# Altium schematic sheet BQ25750.SchDoc
size A4; SheetNumber: 1; SheetTotal: 3
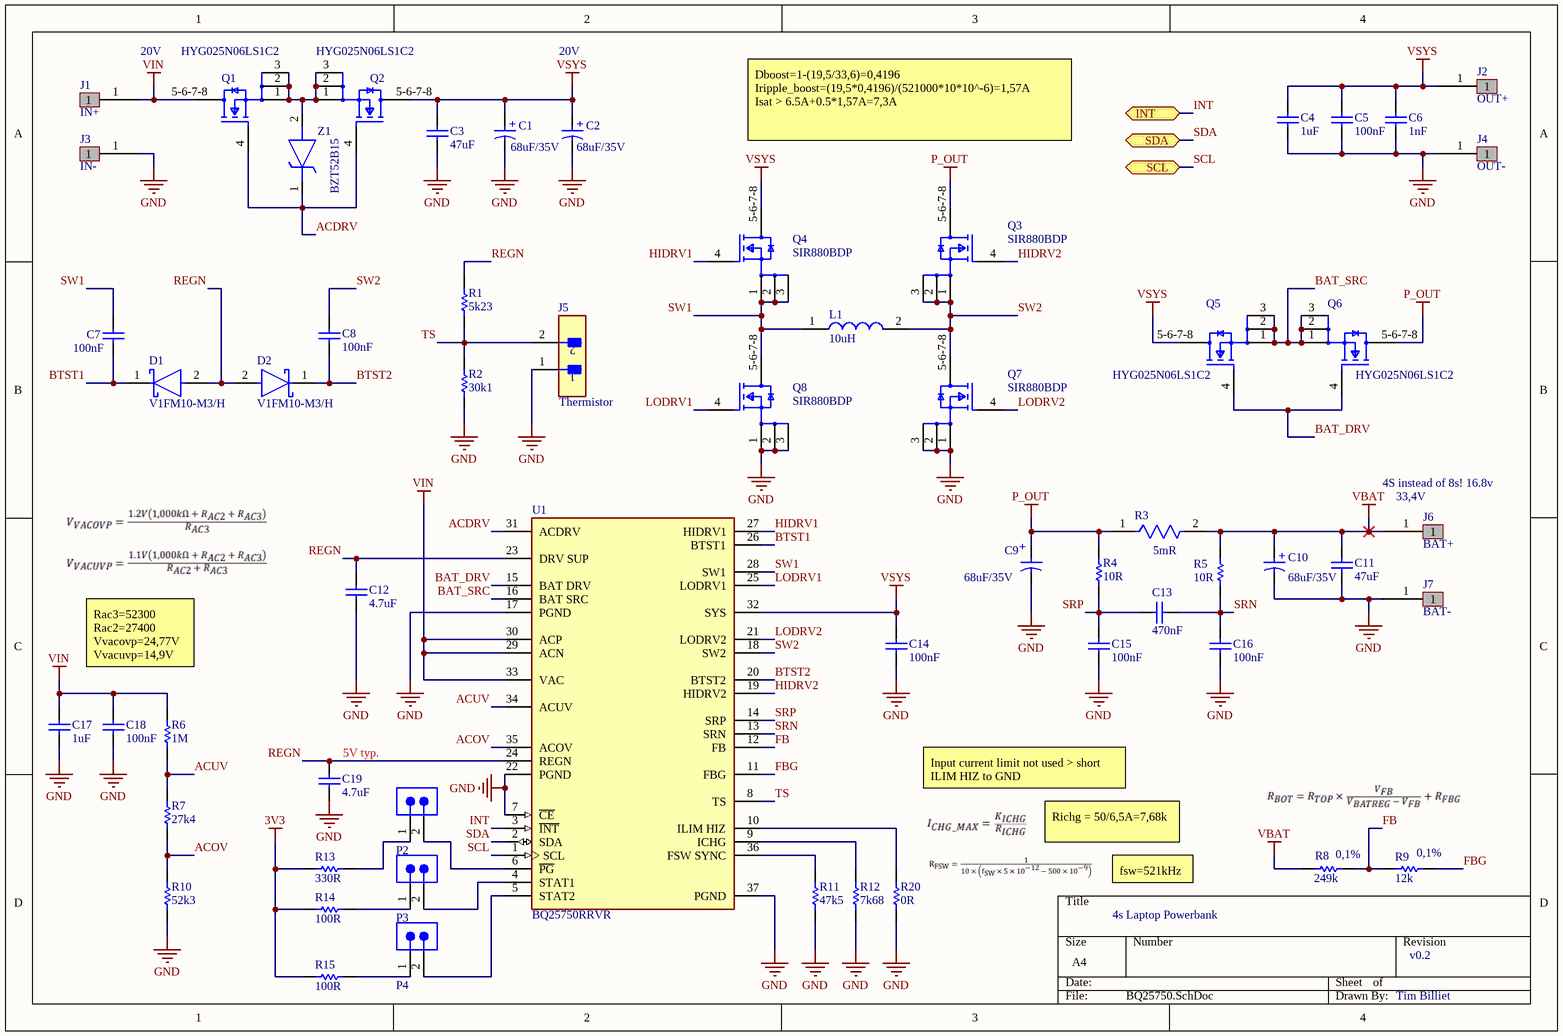
[diagram p0: BQ25750.SchDoc]

## Parts
C1  value 68uF/35V  [Wurth D6.3x7.7mm]  (hidden comment: Nichicon 68uF/35V Elco)
C2  value 68uF/35V  [Wurth D6.3x7.7mm]  (hidden comment: Nichicon 68uF/35V Elco)
C3  value 47uF  [Wurth 1206 Capacitor]  (hidden comment: Generic Capacitor 47uF 1206)
C4  value 1uF  [Wurth 1206 Capacitor]  (hidden comment: Generic Capacitor 1uF 1206)
C5  value 100nF  [Wurth 0603 capacitor]  (hidden comment: Generic Capacitor 100nF 0603)
C6  value 1nF  [Wurth 0603 capacitor]  (hidden comment: Generic Capacitor 1nF 0603)
C7  value 100nF  [Wurth 0603 capacitor]  (hidden comment: Generic Capacitor 100nF 0603)
C8  value 100nF  [Wurth 0603 capacitor]  (hidden comment: Generic Capacitor 100nF 0603)
C9  value 68uF/35V  [Wurth D6.3x7.7mm]  (hidden comment: Nichicon 68uF/35V Elco)
C10  value 68uF/35V  [Wurth D6.3x7.7mm]  (hidden comment: Nichicon 68uF/35V Elco)
C11  value 47uF  [Wurth 1206 Capacitor]  (hidden comment: Generic Capacitor 47uF 1206)
C12  value 4.7uF  [Wurth 0603 capacitor]  (hidden comment: Generic Capacitor 4.7uF 0603)
C13  value 470nF  [Wurth 0603 capacitor]  (hidden comment: Generic Capacitor 470nF 0603)
C14  value 100nF  [Wurth 0603 capacitor]  (hidden comment: Generic Capacitor 100nF 0603)
C15  value 100nF  [Wurth 0603 capacitor]  (hidden comment: Generic Capacitor 100nF 0603)
C16  value 100nF  [Wurth 0603 capacitor]  (hidden comment: Generic Capacitor 100nF 0603)
C17  value 1uF  [Wurth 0603 capacitor]  (hidden comment: Generic Capacitor 1uF 0603)
C18  value 100nF  [Wurth 0603 capacitor]  (hidden comment: Generic Capacitor 100nF 0603)
C19  value 4.7uF  [Wurth 0603 capacitor]  (hidden comment: Generic Capacitor 4.7uF 0603)
D1  V1FM10-M3/H  [FP-V1FM10-M3-H-MFG]
D2  V1FM10-M3/H  [FP-V1FM10-M3-H-MFG]
J1  IN+  [Solder Pad 3X4MM]
J2  OUT+  [Solder Pad 3X4MM]
J3  IN-  [Solder Pad 3X4MM]
J4  OUT-  [Solder Pad 3X4MM]
J5  B2B-PH-K(LF)(SN)  [FP-B2B-PH-K_LF_SN-MFG]  (value not drawn)
J6  BAT+  [Solder Pad 3X4MM]
J7  BAT-  [Solder Pad 3X4MM]
L1  value 10uH  [Cjiang 11.5x10mm inductor]  (hidden comment: Cjiang Inductor 10uH 8A)
P2  61300211121  [2x1 2.54mm F]  (value not drawn)
P3  61300211121  [2x1 2.54mm F]  (value not drawn)
P4  61300211121  [2x1 2.54mm F]  (value not drawn)
Q1  HYG025N06LS1C2  [Huayi PDFN8L]
Q2  HYG025N06LS1C2  [Huayi PDFN8L]
Q3  SIR880BDP  [Vishay PowerPAKSO-8]
Q4  SIR880BDP  [Vishay PowerPAKSO-8]
Q5  HYG025N06LS1C2  [Huayi PDFN8L]
Q6  HYG025N06LS1C2  [Huayi PDFN8L]
Q7  SIR880BDP  [Vishay PowerPAKSO-8]
Q8  SIR880BDP  [Vishay PowerPAKSO-8]
R1  value 5k23  [Wurth 0603 Resistor]  (hidden comment: Generic Resistor 5k23 0603)
R2  value 30k1  [Wurth 0603 Resistor]  (hidden comment: Generic Resistor 30k1 0603)
R3  Resistance: 5mR  [FP-ERJM1WS-MFG]  (hidden comment: ERJ-M1WSF5M0U)
R4  value 10R  [Wurth 0603 Resistor]  (hidden comment: Generic Resistor 10R 0603)
R5  value 10R  [Wurth 0603 Resistor]  (hidden comment: Generic Resistor 10R 0603)
R6  value 1M  [Wurth 0603 Resistor]  (hidden comment: Generic Resistor 1M 0603)
R7  value 27k4  [Wurth 0603 Resistor]  (hidden comment: Generic Resistor 27k4 0603)
R8  value 249k  [Wurth 0603 Resistor]  (hidden comment: Generic Resistor 249k 0603)
R9  value 12k  [Wurth 0603 Resistor]  (hidden comment: Generic Resistor 12k 0603)
R10  value 52k3  [Wurth 0603 Resistor]  (hidden comment: Generic Resistor 52k3 0603)
R11  value 47k5  [Wurth 0603 Resistor]  (hidden comment: Generic Resistor 47k5 0603)
R12  value 7k68  [Wurth 0603 Resistor]  (hidden comment: Generic Resistor 7k68 0603)
R13  value 330R  [Wurth 0603 Resistor]  (hidden comment: Generic Resistor 330R 0603)
R14  value 100R  [Wurth 0603 Resistor]  (hidden comment: Generic Resistor 100R 0603)
R15  value 100R  [Wurth 0603 Resistor]  (hidden comment: Generic Resistor 100R 0603)
R20  value 0R  [Wurth 0603 Resistor]  (hidden comment: Generic Resistor 0R 0603)
U1  BQ25750RRVR  [FP-RRV0036A-MFG]
Z1  BZT52B15  [Yongyutai SOD-123]

## Ports
INT (bidir), SCL (bidir), SDA (bidir)

## Nets
3V3: R13.1 R14.1 R15.1
GND: C1.2(N) C2.2(N) C3.1 C4.1 C5.1 C6.1 C9.2(N) C10.2(N) C11.1 C12.1 C14.1 C15.2 C16.1 C17.1 C18.1 C19.1 J3.1 J4.1 J5.1 J7.1 Q7.1(S) Q7.2(S) Q7.3(S) Q8.1(S) Q8.2(S) Q8.3(S) R2.1 R10.1 R11.1 R12.2 R20.1 U1.7(~{CE}) U1.17(PGND) U1.22(PGND) U1.37(PGND)
P_OUT: C9.1(P) Q3.5-6-7-8(D) Q6.5-6-7-8(D) R3.1 R4.2
VBAT: C10.1(P) C11.2 J6.1 R3.2 R5.2 R8.2
VIN: C17.2 C18.2 J1.1 Q1.5-6-7-8(D) R6.2 U1.29(ACN) U1.30(ACP) U1.33(VAC)
VSYS: C1.1(P) C2.1(P) C3.2 C4.2 C5.2 C6.2 C14.2 J2.1 Q2.5-6-7-8(D) Q4.5-6-7-8(D) Q5.5-6-7-8(D) U1.32(SYS)
ACDRV: Q1.4(G) Q2.4(G) U1.31(ACDRV) Z1.1(K)
ACOV: R7.1 R10.2 U1.35(ACOV)
ACUV: R6.1 R7.2 U1.34(ACUV)
BAT_DRV: Q5.4(G) Q6.4(G) U1.15(BAT_DRV)
BAT_SRC: Q5.1(S) Q5.2(S) Q5.3(S) Q6.1(S) Q6.2(S) Q6.3(S) U1.16(BAT_SRC)
BTST1: C7.1 D1.1(C) U1.26(BTST1)
BTST2: C8.1 D2.1(C) U1.20(BTST2)
FB: R8.1 R9.1 U1.12(FB)
FBG: R9.2 U1.11(FBG)
HIDRV1: Q4.4(G) U1.27(HIDRV1)
HIDRV2: Q3.4(G) U1.19(HIDRV2)
INT: U1.3(~{INT}) ; port INT
LODRV1: Q8.4(G) U1.25(LODRV1)
LODRV2: Q7.4(G) U1.21(LODRV2)
REGN: C12.2 C19.2 D1.2(A) D2.2(A) R1.2 U1.23(DRV_SUP) U1.24(REGN)
SCL: U1.1(SCL) ; port SCL
SDA: U1.2(SDA) ; port SDA
SRN: C13.2 C16.2 R5.1 U1.13(SRN)
SRP: C13.1 C15.1 R4.1 U1.14(SRP)
SW1: C7.2 L1.1 Q4.1(S) Q4.2(S) Q4.3(S) Q8.5-6-7-8(D) U1.28(SW1)
SW2: C8.2 L1.2 Q3.1(S) Q3.2(S) Q3.3(S) Q7.5-6-7-8(D) U1.18(SW2)
TS: J5.2 R1.1 R2.2 U1.8(TS)
NetP2_1: P2.1 R13.2
NetP2_2: P2.2 U1.6(~{PG})
NetP3_1: P3.1 R14.2
NetP3_2: P3.2 U1.4(STAT1)
NetP4_1: P4.1 R15.2
NetP4_2: P4.2 U1.5(STAT2)
NetQ1_1: Q1.1(S) Q1.2(S) Q1.3(S) Q2.1(S) Q2.2(S) Q2.3(S) Z1.2(A)
NetR11_2: R11.2 U1.36(FSW_SYNC)
NetR12_1: R12.1 U1.9(ICHG)
NetR20_2: R20.2 U1.10(ILIM_HIZ)

## Notes on the sheet
- 20V
- Dboost=1-(19,5/33,6)=0,4196
  Iripple_boost=(19,5*0,4196)/(521000*10*10^-6)=1,57A
  Isat > 6.5A+0.5*1,57A=7,3A
- (near J5) Thermistor
- (near J6) 4S instead of 8s! 16.8v
- (near J6) 33,4V
- Rac3=52300
  Rac2=27400
  Vvacovp=24,77V
  Vvacuvp=14,9V
- (near C19) 5V typ.
- Input current limit not used > short ILIM HIZ to GND
- Richg = 50/6,5A=7,68k
- (near R9) 0,1%
- 4s Laptop Powerbank
- fsw=521kHz
- (near R8) 0,1%
- v0.2
- Tim Billiet
- (in symbol Nichicon 68uF/35V Elco) +

## Library data of the parts
D1 D2 = CMP-02539-000045-1: 1A 100V SMF TRENCH SKY RECT; RoHS Compliant: Yes
J1-J4 J6 J7 = Solder pad
J5 = CMP-17439-000674-1: Connector Header Through Hole 2 position 0.079" (2.00mm); Gender: Male; Pitch: 2mm; Voltage Rating: 100V; Current Rating: 2A; Number of Positions: 2; Insulation Resistance: 1GR; Contact Plating: Tin; Color: Beige; Min Operating Temperature: -25°C; Mount: Through Hole; Number of Rows: 1; Termination: Crimp; Max Operating Temperature: 85°C; Lead Free: Lead Free; Contact Material: Brass; Material: Polyamide
L1 = Cjiang Inductor 10uH 8A: Unchecked FXL1050-100-M 8A 10uH Integrated molded inductor ±20% 10A SMD, 10x11.5mm Power Inductors ROHS
P2-P4 = 2P: WR-PHD Pin Header, THT, Vertical, pitch 2.54mm, 1 Row, 2P; Manufacturer: Wurth Elektronik; Contact Resistance: 20mOhm; Rated Current: 3A; Working Voltage: 250V; Withstanding Voltage: 500V; Manufacturer Part Number: 61300211121; Category: Board-to-Board Connectors; Match Code: WR-PHD; ComponentLink1Description: Website Link; ComponentLink1URL: https://www.we-online.com/redexpert/article/61300211121?ad; ComponentLink2Description: Datasheet Link; ComponentLink2URL: https://www.we-online.com/redexpert/spec/61300211121?ad; Mount: Through Hole; Operating Temperature Max: 105°C; Operating Temperature Min: -40°C; Packaging: Bag; Gender: Pin Header; Number of Pins: 2; Number of Rows: 1; Orientation: Vertical; Pitch: 2.54mm
Q1 Q2 Q5 Q6 = Huayi HYG025N06LS1C2: MOSFET N-CH VDS = 60V,ID = 170A, VGS = 20V PDFN8L; ComponentLink2Description: Datasheet; ComponentLink2URL: https://www.diodes.com/assets/Datasheets/ds30938.pdf
Q3 Q4 Q7 Q8 = Vishay SIR880BDP: Mosfet, N-Ch, 80V, 70.6A, 150Degc, 71.4W Rohs Compliant: Yes |Vishay SIR880BDP-T1-RE3; Manufacturer: Vishay; Manufacturer Package Identifier: S17-0173-Single; Drain to Source Resistance: 8mΩ; Gate to Source Voltage (Vgs): 20V; Max Junction Temperature (Tj): 150°C; Number of Channels: 1; Power Dissipation: 5W; Turn-Off Delay Time: 40ns; Turn-On Delay Time: 12ns; Supplier: RS; Supplier Part Number: 2282914; Manufacturer Part Number: SIR880BDP-T1-RE3; RoHS: Compliant; Category: MOSFETs; Stock: 5590; Pricing: 10=1,116, 100=1,05, 250=0,949, 500=0,893, 1000=0,838 (EUR); Continuous Drain Current (ID): 70.6A; Drain to Source Breakdown Voltage: 80V; Drain to Source Voltage (Vdss): 80V; Height: 1.12mm; Lifecycle Status: Production; Max Operating Temperature: 150°C; Max Power Dissipation: 71.4W; Min Breakdown Voltage: 80V; Min Operating Temperature: -55°C; Number of Elements: 1; Number of Terminals: 8; ComponentLink1URL: https://datasheet.octopart.com:443/SIR880BDP-T1-RE3-Vishay-datasheet-165496184.pdf?src-supplier=Upverter; ComponentLink1Description: https://datasheet.octopart.com:443/SIR880BDP-T1-RE3-Vishay-datasheet-165496184.pdf?src-supplier=Upverter; ComponentLink2URL: https://sigma.octopart.com:443/138898934/technical_drawing/Vishay-SIR880BDP-T1-RE3.pdf?src-supplier=Upverter; ComponentLink2Description: https://sigma.octopart.com:443/138898934/technical_drawing/Vishay-SIR880BDP-T1-RE3.pdf?src-supplier=Upverter; ComponentLink3URL: https://datasheet.octopart.com:443/SIR880BDP-T1-RE3-Vishay-datasheet-181474081.pdf?src-supplier=IHS; ComponentLink3Description: https://datasheet.octopart.com:443/SIR880BDP-T1-RE3-Vishay-datasheet-181474081.pdf?src-supplier=IHS; ComponentLink4URL: http://sigma.octopart.com:80/rohs_statement/Vishay-company-15.pdf?src-supplier=Compliance+Statements; ComponentLink4Description: http://sigma.octopart.com:80/rohs_statement/Vishay-company-15.pdf?src-supplier=Compliance+Statements
R3 = CMP-05422-000103-1: RES 0.005 OHM 1% 1W 2512; Temperature Coefficient: 100ppm/°C; Construction: Rectangular; Mount: Surface Mount; Case/Package: 2512; Package Quantity: 1; Technology: THICK FILM; RoHS Compliant: Yes; REACH SVHC: No SVHC; Size Code: 2512; Number of Terminations: 2; Max Operating Temperature: 170°C; Number of Pins: 2; Case Code (Metric): 6432; Depth: 3.2mm; Case Code (Imperial): 2512; Max Power Dissipation: 1W; Termination: SMD/SMT; Power Rating: 1W; Radiation Hardening: No; Tolerance: 1%; Packaging: Tape and Reel; Resistor Type: Metal Strip; Military Standard: Not; Lead Free: Lead Free; Height: 0.8mm; Min Operating Temperature: -55°C; Width: 3.2mm; Series: ERJ; Length: 6.4mm; Resistance Tolerance: 1%; Contact Plating: Tin
U1 = CMP-00370-145540039-1: BQ25750RRVR Stand-alone or I²C-controlled 70-V bidirectional buck-boost charge controller with power path 36-VQFN -40 to 125; Manufacturer Lifecycle Status: ACTIVE; Number of Cells: 16; Output Current: 20A; Min Supply Voltage: 4.2V; Max Supply Voltage: 70V; Max Junction Temperature (Tj): 125°C; Width: 5mm; Max Operating Temperature: 125°C; Number of Pins: 36; Ambient Temperature Range High: 105°C; Lifecycle Status: Production; Length: 6mm; Height: 0m; Min Operating Temperature: -40°C; Thickness: 900µm; NexarPartId: 145540039; Case/Package: VQFN
Z1 = BZT52B15: Zener Diode; Manufacturer_Name: Vishay; Manufacturer_Part_Number: BZT52B15-E3-18; Datasheet Link: https://www.vishay.com/docs/85760/bzt52.pdf; Height: 1.35mm; Mouser Part Number: 78-BZT52B15-E3-18; Mouser Price/Stock: https://www.mouser.co.uk/ProductDetail/Vishay-Semiconductors/BZT52B15-E3-18?qs=KP8Io%2FXyE5SvlbRZ336LSg%3D%3D; Arrow Part Number: BZT52B15-E3-18; Arrow Price/Stock: https://www.arrow.com/en/products/bzt52b15-e3-18/vishay?region=nac